# EasyEDA schematic SCH_Hackathon_2025-03-07.json
TITLE: Sheet_1; REV: 1.0; Date: 2025-03-06; Sheet: 1/1; Drawn By: rocky_tech; Company: Your Company
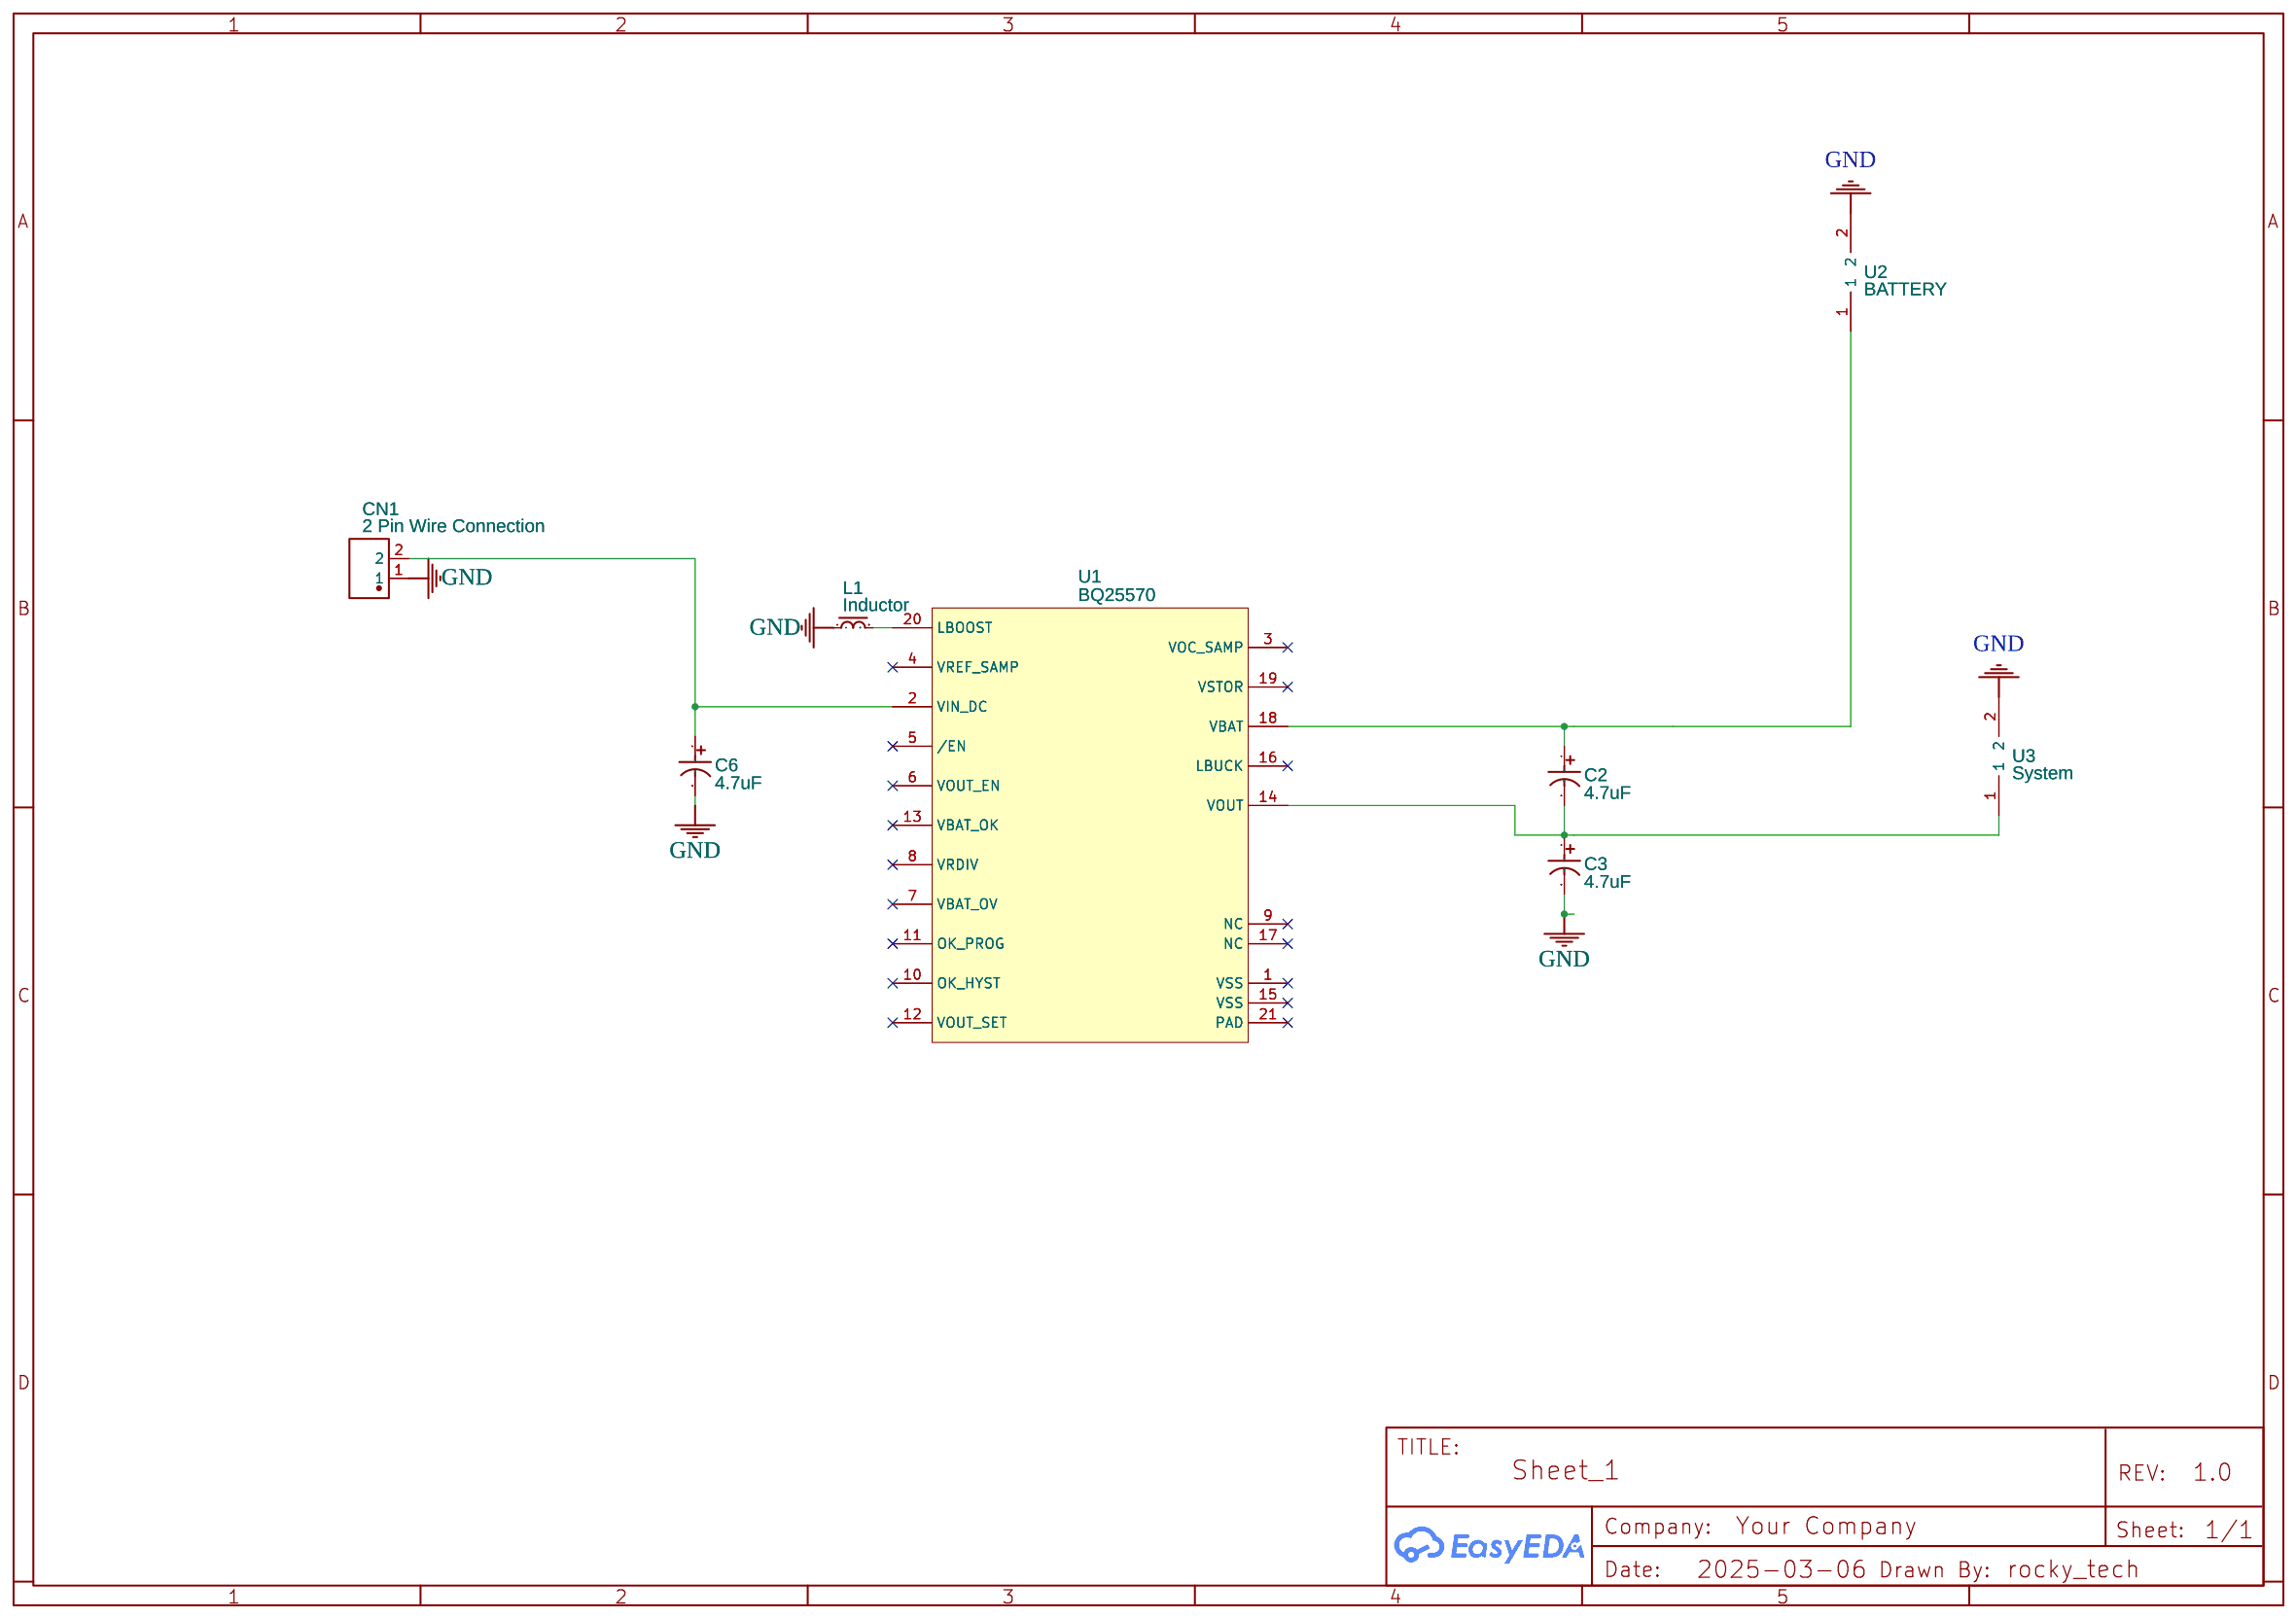
[diagram p0: schematic sheet]

## Parts
C2  4.7uF  [CAP-TH_BD8.0-P3.50-D0.6-FD_1]
C3  4.7uF  [CAP-TH_BD8.0-P3.50-D0.6-FD_1]
C6  4.7uF  [CAP-TH_BD8.0-P3.50-D0.6-FD_1]
CN1  2 Pin Wire Connection  [2 PIN CONNECTION]
L1  Inductor  [INDUCTOR]
U1  BQ25570  [BQ25570]
U2  BATTERY  [2.54 MM 2X1 THT MALE PIN HEADER]
U3  System  [2.54 MM 2X1 THT MALE PIN HEADER]

## Library data of the parts
C2 C3 C6 = 250V 4.7uF 8X12: Supplier: LCSC; Manufacturer: CX(承兴); Manufacturer Part: KM475M250F12RR0VH2FP0; Supplier Part: C2775; JLCPCB Part Class: Extended Part
CN1 = 2 Pin Wire Connection: Contributor: Ergonomyx
L1 = Inductor: Contributor: cazzani
U1 = BQ25570: Digi-Key Part Number: 296-37014-1-ND; Manufacturer: Texas Instruments; Manufacturer Part Number: bq25570; Rating: *; Note: *; Contributor: saleemqkhan
U2 U3 = 2.54 mm 2x1 THT male pin header: Contributor: ash945

## Nets
GND: C3.2 C6.2 CN1.1 L1.1 U2.2 U3.2
Net-(C2-1): C2.1 U1.18(VBAT) U2.1
Net-(C2-2): C2.2 C3.1 U1.14(VOUT) U3.1
Net-(C6-1): C6.1 CN1.2 U1.2(VIN_DC)
Net-(L1-2): L1.2 U1.20(LBOOST)

Not connected (* = marked no-connect by the designer): U1 1(VSS)* 3(VOC_SAMP)* 4(VREF_SAMP)* 5(/EN)* 6(VOUT_EN)* 7(VBAT_OV)* 8(VRDIV)* 9(NC)* 10(OK_HYST)* 11(OK_PROG)* 12(VOUT_SET)* 13(VBAT_OK)* 15(VSS)* 16(LBUCK)* 17(NC)* 19(VSTOR)* 21(PAD)*
